# EAGLE design registers_half_block (EAGLE 9.5.2)
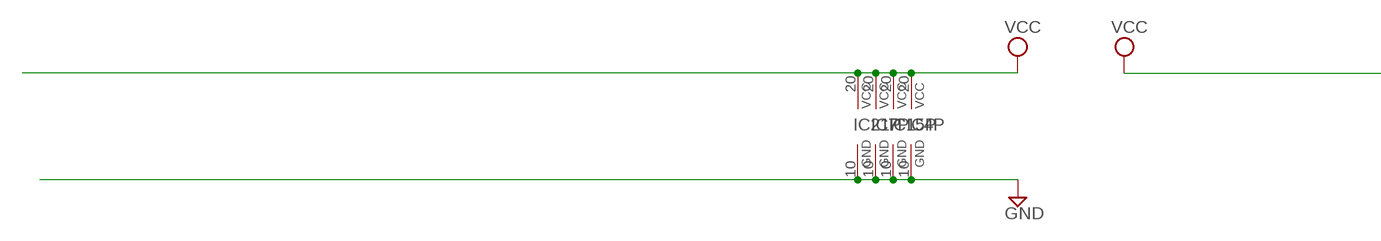
[diagram p0: schematic, sheet 1, part 1 of 3]
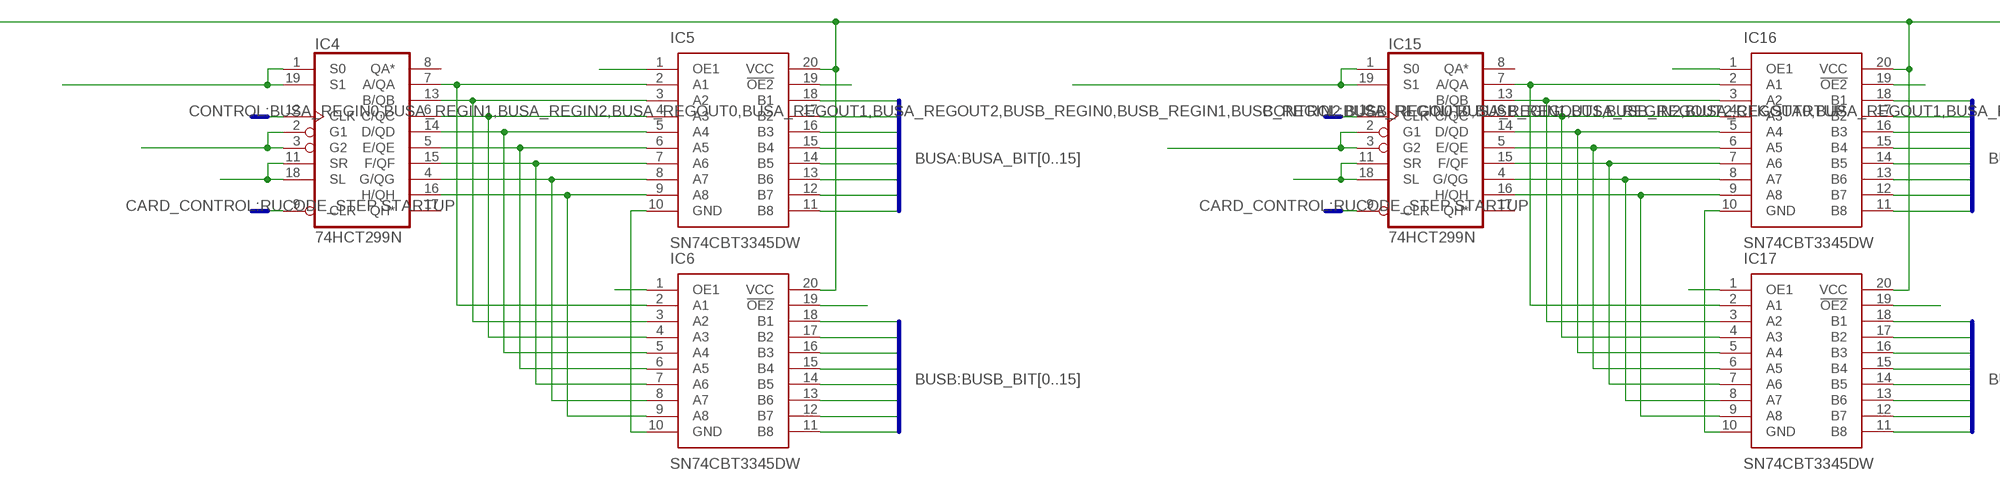
[diagram p1: schematic, sheet 1, part 2 of 3]
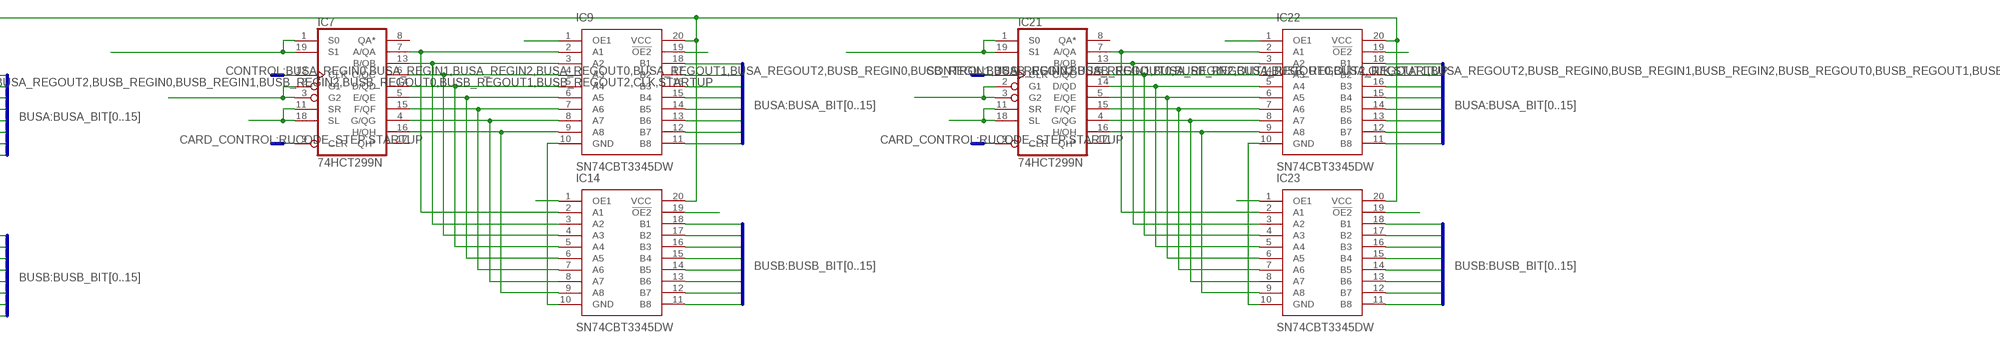
[diagram p2: schematic, sheet 1, part 3 of 3]

## Parts
IC4  74HCT299N  [DIL20]
IC5  SN74CBT3345DW  [SOIC127P1030X265-20N]
IC6  SN74CBT3345DW  [SOIC127P1030X265-20N]
IC7  74HCT299N  [DIL20]
IC9  SN74CBT3345DW  [SOIC127P1030X265-20N]
IC14  SN74CBT3345DW  [SOIC127P1030X265-20N]
IC15  74HCT299N  [DIL20]
IC16  SN74CBT3345DW  [SOIC127P1030X265-20N]
IC17  SN74CBT3345DW  [SOIC127P1030X265-20N]
IC21  74HCT299N  [DIL20]
IC22  SN74CBT3345DW  [SOIC127P1030X265-20N]
IC23  SN74CBT3345DW  [SOIC127P1030X265-20N]

## Nets
BUSA_BIT0: IC5.18(B1) IC9.18(B1) IC16.18(B1) IC22.18(B1)
BUSA_BIT1: IC5.17(B2) IC9.17(B2) IC16.17(B2) IC22.17(B2)
BUSA_BIT2: IC5.16(B3) IC9.16(B3) IC16.16(B3) IC22.16(B3)
BUSA_BIT3: IC5.15(B4) IC9.15(B4) IC16.15(B4) IC22.15(B4)
BUSA_BIT4: IC5.14(B5) IC9.14(B5) IC16.14(B5) IC22.14(B5)
BUSA_BIT5: IC5.13(B6) IC9.13(B6) IC16.13(B6) IC22.13(B6)
BUSA_BIT6: IC5.12(B7) IC9.12(B7) IC16.12(B7) IC22.12(B7)
BUSA_BIT7: IC5.11(B8) IC9.11(B8) IC16.11(B8) IC22.11(B8)
BUSB_BIT0: IC6.18(B1) IC14.18(B1) IC17.18(B1) IC23.18(B1)
BUSB_BIT1: IC6.17(B2) IC14.17(B2) IC17.17(B2) IC23.17(B2)
BUSB_BIT2: IC6.16(B3) IC14.16(B3) IC17.16(B3) IC23.16(B3)
BUSB_BIT3: IC6.15(B4) IC14.15(B4) IC17.15(B4) IC23.15(B4)
BUSB_BIT4: IC6.14(B5) IC14.14(B5) IC17.14(B5) IC23.14(B5)
BUSB_BIT5: IC6.13(B6) IC14.13(B6) IC17.13(B6) IC23.13(B6)
BUSB_BIT6: IC6.12(B7) IC14.12(B7) IC17.12(B7) IC23.12(B7)
BUSB_BIT7: IC6.11(B8) IC14.11(B8) IC17.11(B8) IC23.11(B8)
CLK: IC4.12(CLK) IC7.12(CLK) IC15.12(CLK) IC21.12(CLK)
GND: IC4.10(GND) IC7.10(GND) IC15.10(GND) IC21.10(GND)
N$1: IC5.19(!OE2)
N$2: IC21.11(SR) IC21.18(SL)
N$4: IC16.19(!OE2)
N$5: IC4.7(A/QA) IC5.2(A1) IC6.2(A1)
N$6: IC4.13(B/QB) IC5.3(A2) IC6.3(A2)
N$7: IC4.6(C/QC) IC5.4(A3) IC6.4(A3)
N$8: IC4.14(D/QD) IC5.5(A4) IC6.5(A4)
N$9: IC4.5(E/QE) IC5.6(A5) IC6.6(A5)
N$10: IC4.15(F/QF) IC5.7(A6) IC6.7(A6)
N$11: IC4.4(G/QG) IC5.8(A7) IC6.8(A7)
N$12: IC17.19(!OE2)
N$13: IC14.1(OE1)
N$14: IC9.19(!OE2)
N$15: IC4.16(H/QH) IC5.9(A8) IC6.9(A8)
N$17: IC14.19(!OE2)
N$18: IC22.19(!OE2)
N$19: IC23.19(!OE2)
N$20: IC23.1(OE1)
N$22: IC7.7(A/QA) IC9.2(A1) IC14.2(A1)
N$23: IC7.13(B/QB) IC9.3(A2) IC14.3(A2)
N$24: IC7.6(C/QC) IC9.4(A3) IC14.4(A3)
N$25: IC7.14(D/QD) IC9.5(A4) IC14.5(A4)
N$28: IC7.5(E/QE) IC9.6(A5) IC14.6(A5)
N$30: IC4.11(SR) IC4.18(SL)
N$31: IC5.10(GND) IC6.10(GND)
N$32: IC15.11(SR) IC15.18(SL)
N$33: IC16.10(GND) IC17.10(GND)
N$34: IC5.1(OE1)
N$35: IC7.15(F/QF) IC9.7(A6) IC14.7(A6)
N$36: IC7.4(G/QG) IC9.8(A7) IC14.8(A7)
N$37: IC7.16(H/QH) IC9.9(A8) IC14.9(A8)
N$39: IC7.11(SR) IC7.18(SL)
N$40: IC9.10(GND) IC14.10(GND)
N$41: IC15.7(A/QA) IC16.2(A1) IC17.2(A1)
N$42: IC15.13(B/QB) IC16.3(A2) IC17.3(A2)
N$43: IC15.6(C/QC) IC16.4(A3) IC17.4(A3)
N$44: IC15.14(D/QD) IC16.5(A4) IC17.5(A4)
N$45: IC15.5(E/QE) IC16.6(A5) IC17.6(A5)
N$46: IC15.15(F/QF) IC16.7(A6) IC17.7(A6)
N$47: IC15.4(G/QG) IC16.8(A7) IC17.8(A7)
N$48: IC15.16(H/QH) IC16.9(A8) IC17.9(A8)
N$50: IC22.10(GND) IC23.10(GND)
N$63: IC21.7(A/QA) IC22.2(A1) IC23.2(A1)
N$64: IC21.13(B/QB) IC22.3(A2) IC23.3(A2)
N$65: IC21.6(C/QC) IC22.4(A3) IC23.4(A3)
N$66: IC21.14(D/QD) IC22.5(A4) IC23.5(A4)
N$67: IC21.5(E/QE) IC22.6(A5) IC23.6(A5)
N$68: IC21.15(F/QF) IC22.7(A6) IC23.7(A6)
N$69: IC21.4(G/QG) IC22.8(A7) IC23.8(A7)
N$70: IC21.16(H/QH) IC22.9(A8) IC23.9(A8)
N$123: IC6.1(OE1)
N$124: IC6.19(!OE2)
N$127: IC4.2(G1) IC4.3(G2)
N$128: IC4.1(S0) IC4.19(S1)
N$137: IC15.2(G1) IC15.3(G2)
N$138: IC15.1(S0) IC15.19(S1)
N$147: IC7.2(G1) IC7.3(G2)
N$148: IC7.1(S0) IC7.19(S1)
N$157: IC21.2(G1) IC21.3(G2)
N$158: IC21.1(S0) IC21.19(S1)
N$169: IC16.1(OE1)
N$170: IC17.1(OE1)
N$171: IC9.1(OE1)
N$175: IC22.1(OE1)
STARTUP: IC4.9(CLR) IC7.9(CLR) IC15.9(CLR) IC21.9(CLR)
VCC: IC4.20(VCC) IC5.20(VCC) IC6.20(VCC) IC7.20(VCC) IC9.20(VCC) IC14.20(VCC) IC15.20(VCC) IC16.20(VCC) IC17.20(VCC) IC21.20(VCC) IC22.20(VCC) IC23.20(VCC)
Unconnected: IC4.8(QA*) IC4.17(QH*) IC7.8(QA*) IC7.17(QH*) IC15.8(QA*) IC15.17(QH*) IC21.8(QA*) IC21.17(QH*)

## Buses
CONTROL:BUSA_REGIN0,BUSA_REGIN1,BUSA_REGIN2,BUSA_REGOUT0,BUSA_REGOUT1,BUSA_REGOUT2,BUSB_REGIN0,BUSB_REGIN1,BUSB_REGIN2,BUSB_REGOUT0,BUSB_REGOUT1,BUSB_REGOUT2,CLK,STARTUP
CARD_CONTROL:RUCODE_STEP,STARTUP
BUSA:BUSA_BIT[0..15]
BUSB:BUSB_BIT[0..15]

## Library data of the parts
IC4 IC7 IC15 IC21 = 74xx-eu:74*299: 8-bit universal SHIFT/STORAGE REGISTER
IC5 IC6 IC9 IC14 IC16 IC17 IC22 IC23 = SamacSys_Parts:SN74CBT3345DW: Texas Instruments SN74CBT3345DW, Bus Switch, 8 x 1:1, 4.5 5.5 V, 20-Pin SOIC Source: Datasheet <https://www.ti.com/lit/ds/symlink/sn74cbt3345.pdf>; DESCRIPTION: Texas Instruments SN74CBT3345DW, Bus Switch, 8 x 1:1, 4.5 5.5 V, 20-Pin SOIC; HEIGHT: 2.65mm; MANUFACTURER_NAME: Texas Instruments; MANUFACTURER_PART_NUMBER: SN74CBT3345DW

## Board
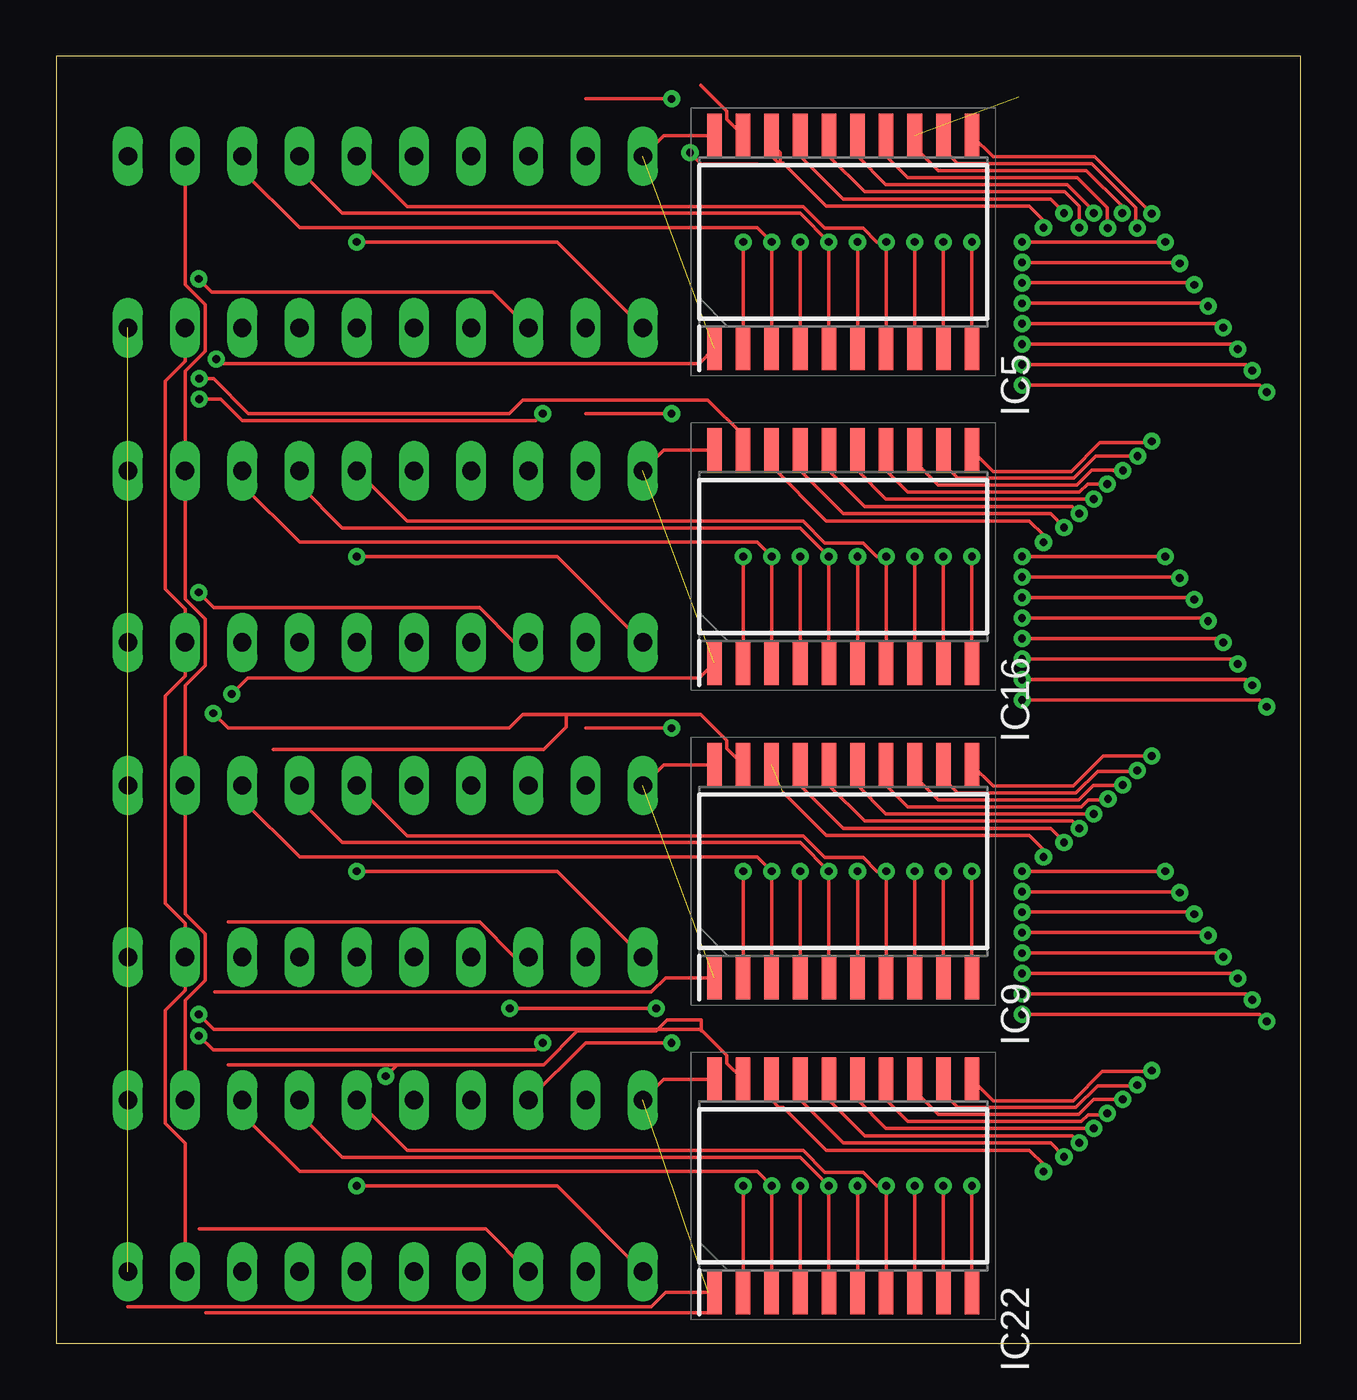
[diagram p3: board, top side]
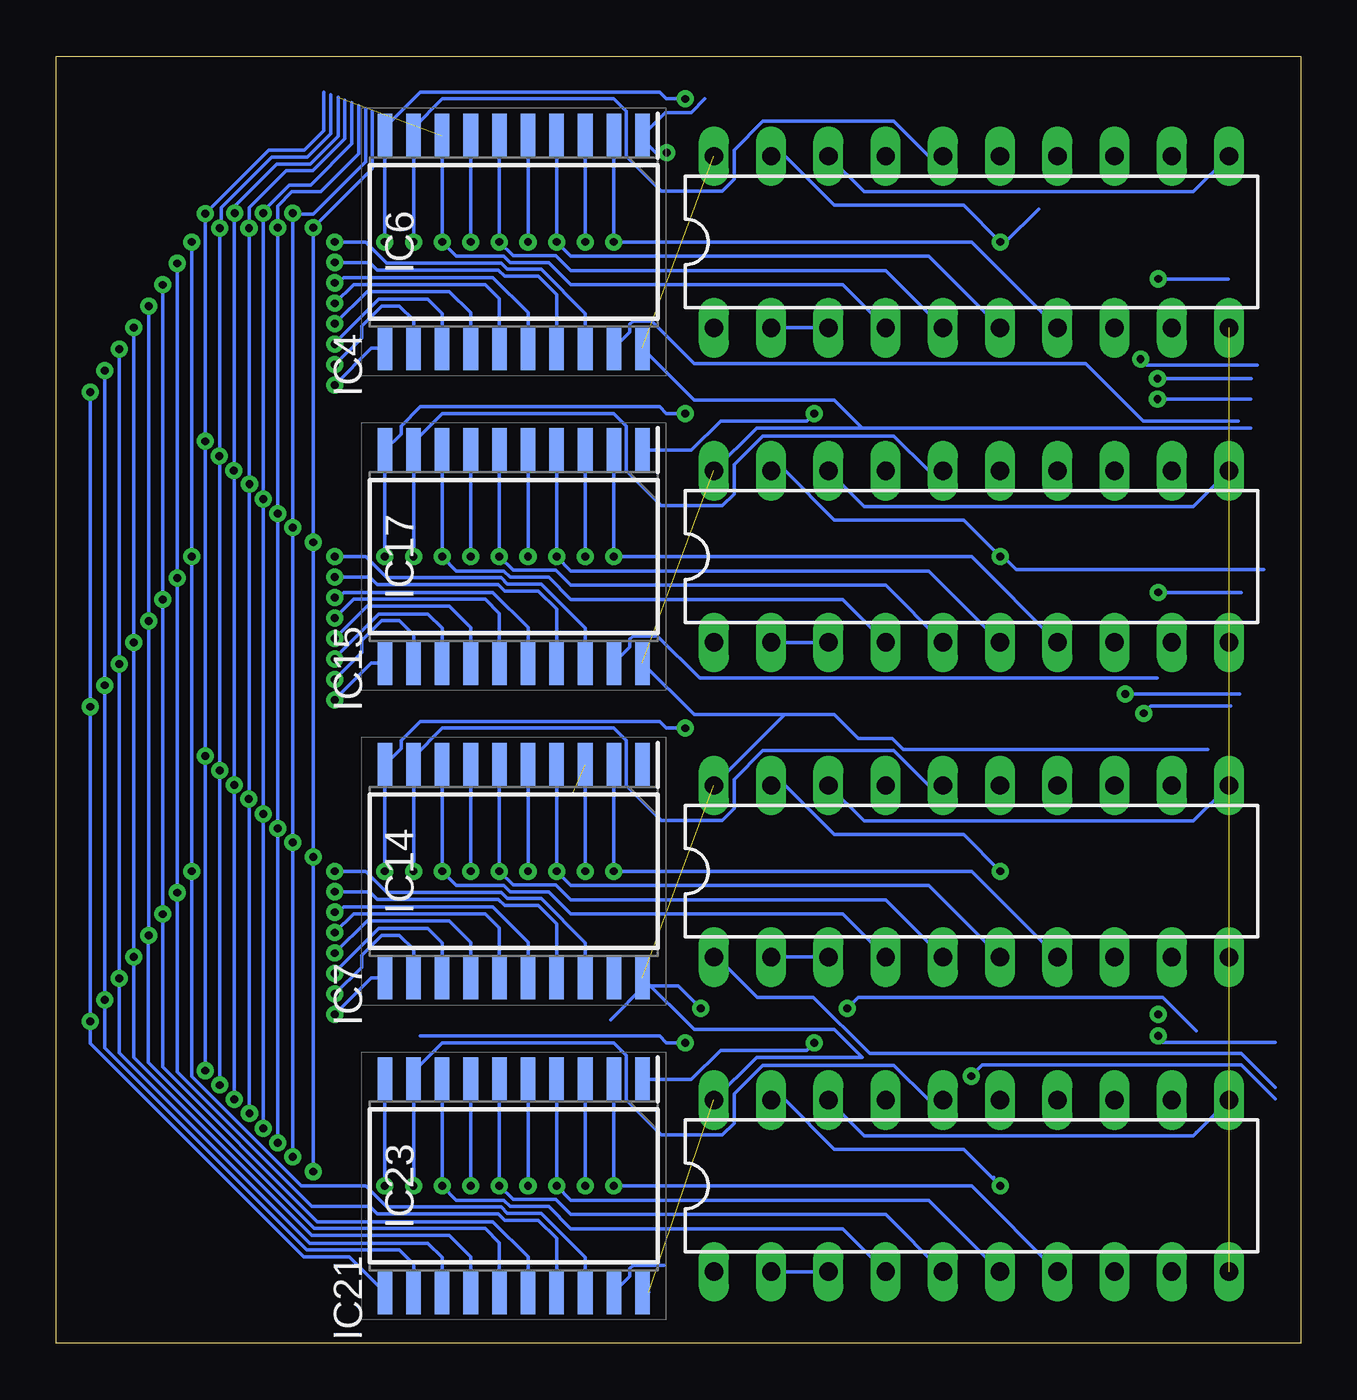
[diagram p4: board, bottom side, seen from below]

Size 55.23 x 57.14 mm. Coordinates in mm from the lower left corner, seen from the top.
Outline: 0,0 55.23,0 55.23,57.14 0,57.14 0,0
Copper layers (1*16): Top 0.035mm / dielectric 1.5mm / Bottom 0.035mm
Design rules "default *": minimum track width 6mil, minimum drill 0.35mm, track to track 6mil, track to pad 6mil, pad to pad 6mil, via to via 6mil, smd to smd 6mil, copper to edge 40mil, drill to drill 6mil, minimum pad ring 10mil, minimum via ring 8mil, stop-mask expansion 4mil, vias tented up to drill 0mil, thermal gap 10mil

### Footprints (pad centres in the part's own frame; a part is rotated, then mirrored left to right if it is on the bottom)
DIL20 = drill 0.813 long: 1 -11.43,-3.81; 2 -8.89,-3.81; 3 -6.35,-3.81; 4 -3.81,-3.81; 5 -1.27,-3.81; 6 1.27,-3.81; 7 3.81,-3.81; 8 6.35,-3.81; 9 8.89,-3.81; 10 11.43,-3.81; 11 11.43,3.81; 12 8.89,3.81; 13 6.35,3.81; 14 3.81,3.81; 15 1.27,3.81; 16 -1.27,3.81; 17 -3.81,3.81; 18 -6.35,3.81; 19 -8.89,3.81; 20 -11.43,3.81
SOIC127P1030X265-20N = smd 1.95 x 0.65: 1 -4.725,5.715; 2 -4.725,4.445; 3 -4.725,3.175; 4 -4.725,1.905; 5 -4.725,0.635; 6 -4.725,-0.635; 7 -4.725,-1.905; 8 -4.725,-3.175; 9 -4.725,-4.445; 10 -4.725,-5.715; 11 4.725,-5.715; 12 4.725,-4.445; 13 4.725,-3.175; 14 4.725,-1.905; 15 4.725,-0.635; 16 4.725,0.635; 17 4.725,1.905; 18 4.725,3.175; 19 4.725,4.445; 20 4.725,5.715

### Placement (x,y rotation side)
IC4  14.61,48.9 0 bottom
IC5  34.92,48.9 90 top
IC6  34.92,48.9 270 bottom
IC7  14.61,20.95 0 bottom
IC9  34.92,20.95 90 top
IC14  34.92,20.95 270 bottom
IC15  14.61,34.92 0 bottom
IC16  34.92,34.92 90 top
IC17  34.92,34.92 270 bottom
IC21  14.61,6.99 0 bottom
IC22  34.92,6.99 90 top
IC23  34.92,6.99 270 bottom

### Tracks (layer width: path | path; a pad name or v marks a point on that pad's centre or on a via)
BUSA_BIT0  (via drill 0.35)  (1 unrouted)
  Top 0.152: v43.81,49.53 43.81,49.85 43.18,50.48 34.18,50.48 32.27,52.39 32.12,52.39 | 31.75,52.7 32.07,52.39 32.12,52.39 | v43.81,35.56 43.81,35.88 43.18,36.51 34.18,36.51 31.75,38.94 IC16.18 31.62,39.36 | v43.81,21.59 43.81,21.91 43.18,22.54 34.18,22.54 32.27,24.45 | v43.81,7.62 43.81,7.94 43.18,8.57 34.18,8.57 32.27,10.48 32.07,10.48 31.75,10.79 IC22.18 | 31.62,25.86 IC9.18 | 32.12,52.39 32.12,52.86 31.62,53.36 IC5.18 | 32.12,52.36 32.12,52.39
  Bottom 0.152: v43.81,7.62 v43.81,21.59 v43.81,35.56 v43.81,49.53 41.19,52.15 41.19,54.69
BUSA_BIT1  (via drill 0.35)
  Top 0.152: v44.72,50.18 44.72,50.21 44.13,50.8 34.92,50.8 33.02,52.7 IC5.17 | v44.72,36.21 44.72,36.24 44.13,36.83 34.92,36.83 33.02,38.73 IC16.17 | v44.72,22.24 44.72,22.27 44.13,22.86 34.92,22.86 33.02,24.77 IC9.17 | v44.72,8.27 44.72,8.3 44.13,8.89 34.92,8.89 33.02,10.79 IC22.17
  Bottom 0.152: v44.72,8.27 v44.72,22.24 v44.72,36.21 v44.72,50.18 44.68,50.14 43.81,50.14 41.5,52.45 41.5,54.82
BUSA_BIT2  (via drill 0.35)
  Top 0.152: v45.4,49.53 45.4,50.48 44.77,51.12 35.88,51.12 34.29,52.7 IC5.16 | v45.4,36.83 45.09,37.15 35.88,37.15 34.29,38.73 IC16.16 | v45.4,22.86 45.09,23.18 35.88,23.18 34.29,24.77 IC9.16 | v45.4,8.89 45.09,9.21 35.88,9.21 34.29,10.79 IC22.16
  Bottom 0.152: v45.4,8.89 v45.4,22.86 v45.4,36.83 v45.4,49.53 45.4,50.48 44.77,51.12 43.5,51.12 41.8,52.81 41.8,54.94
BUSA_BIT3  (via drill 0.35)
  Top 0.152: IC5.15 35.56,52.7 36.82,51.45 44.87,51.45 46.05,50.27 v46.05,50.17 | IC16.15 35.56,38.73 36.82,37.48 v46.04,37.48 v46.05,37.47 | IC9.15 35.56,24.77 36.82,23.51 v46.04,23.51 v46.05,23.5 | IC22.15 35.56,10.79 36.82,9.53 v46.05,9.53
  Bottom 0.152: 42.11,55.07 42.11,53.26 43.94,51.42 44.89,51.42 46.05,50.27 v46.05,50.17 v46.05,37.47 v46.05,23.5 v46.05,9.53
BUSA_BIT4  (via drill 0.35, 0.35 pad 0.55)
  Top 0.152: IC5.14 36.83,52.7 37.78,51.75 45.32,51.75 46.65,50.42 46.65,49.52 v46.67,49.5 | IC16.14 36.83,38.73 37.78,37.78 45.4,37.78 45.77,38.15 v46.65,38.15 | IC9.14 36.83,24.77 37.78,23.81 45.5,23.81 45.79,24.11 46.63,24.11 v46.68,24.16 | IC22.14 36.83,10.79 37.78,9.84 45.5,9.84 45.79,10.14 46.58,10.14 v46.65,10.21
  Bottom 0.152: 42.41,55.2 42.41,53.47 43.84,52.05 45.03,52.05 46.65,50.42 46.65,49.52 v46.67,49.5 46.65,49.48 v46.65,38.15 46.65,24.18 | v46.65,10.21 46.65,24.18 | v46.68,24.16 46.65,24.18
BUSA_BIT5  (via drill 0.35, 0.35 pad 0.55)  (1 unrouted)
  Top 0.152: IC5.13 38.1,53.1 39.13,52.07 45.72,52.07 47.31,50.48 v47.31,50.16 | IC16.13 38.1,39.13 39.13,38.1 45.29,38.1 45.95,38.76 46.9,38.76 46.91,38.75 v47.34,38.75 | IC9.13 38.1,25.16 39.13,24.13 45.38,24.13 46.02,24.76 47.3,24.76 v47.33,24.79 | IC22.13 38.1,11.19 39.13,10.16 45.38,10.16 46.04,10.82 v47.33,10.82
  Bottom 0.152: v47.33,10.82 v47.33,24.79 47.33,38.42 | 42.72,55.32 42.72,53.6 43.96,52.35 45.44,52.35 47.33,50.46 47.33,38.42 | 47.33,38.42 47.34,38.43 v47.34,38.75
BUSA_BIT6  (via drill 0.35, 0.35 pad 0.55)
  Top 0.152: IC5.12 39.37,53.01 40.01,52.38 45.96,52.38 47.91,50.42 47.91,49.56 v47.97,49.5 | IC16.12 39.37,39.04 40.01,38.41 45.16,38.41 46.14,39.38 v47.99,39.38 | IC9.12 39.37,25.07 40.01,24.43 45.26,24.43 46.22,25.39 47.94,25.39 v47.97,25.43 | IC22.12 39.37,11.1 40.01,10.46 45.26,10.46 46.22,11.43 47.94,11.43 v47.97,11.46
  Bottom 0.152: 45.4,52.66 44.09,52.66 43.04,53.7 43.04,55.43 | v47.97,11.46 v47.97,25.43 47.97,39.69 | v47.97,11.46 | 47.97,48.29 | 47.97,39.69 47.97,48.29 | 47.97,39.69 47.99,39.67 v47.99,39.38 | 47.97,48.29 v47.97,49.5 | v47.97,49.5 | 45.4,52.66 | v47.97,49.5 47.91,49.56 47.91,50.42 45.67,52.66 45.4,52.66
BUSA_BIT7  (via drill 0.35, 0.35 pad 0.55)
  Top 0.152: IC5.11 41.58,52.68 46.08,52.68 48.22,50.54 v48.62,50.14 | IC9.11 41.58,24.74 45.13,24.74 46.46,26.07 v48.62,26.07 | IC22.11 41.58,10.77 45.13,10.77 46.43,12.07 48.58,12.07 v48.62,12.1 | IC16.11 41.58,38.71 45.04,38.71 46.32,39.99 48.56,39.99 v48.62,40.04 | v48.62,26.07
  Bottom 0.152: 43.35,55.55 43.35,53.83 44.21,52.97 45.8,52.97 48.22,50.54 v48.62,50.14 | v48.62,12.1 v48.62,26.07 | v48.62,26.07 | v48.62,26.07 v48.62,40.04 | v48.62,40.04 | v48.62,50.14 | v48.62,40.04 v48.62,50.14
BUSB_BIT0  (via drill 0.35)
  Top 0.152: v42.86,48.9 v49.22,48.9 | v42.86,20.95 v49.22,20.95 | v49.22,34.92 v42.86,34.92
  Bottom 0.152: IC6.18 31.75,45.72 33.71,47.68 35.21,47.68 35.48,47.95 40.56,47.95 41.5,48.9 v42.86,48.9 | IC17.18 31.75,31.75 33.71,33.71 35.21,33.71 35.48,33.98 40.56,33.98 41.5,34.92 v42.86,34.92 | IC14.18 31.75,17.78 33.71,19.74 35.21,19.74 35.48,20.02 40.56,20.02 41.5,20.95 v42.86,20.95 | IC23.18 31.75,3.81 33.71,5.77 35.21,5.77 35.48,6.04 40.56,6.04 41.5,6.99 44.36,6.99 49.22,11.85 v49.22,20.95 49.22,34.61 | 49.22,34.61 v49.22,48.9 | v49.22,48.9 | 49.22,34.61 | 49.22,34.61 v49.22,34.92
BUSB_BIT1  (via drill 0.35, 0.35 pad 0.55)
  Top 0.152: v42.86,34.02 49.82,34.02 v49.86,33.97 | v42.86,20.05 49.82,20.05 v49.86,20 | v42.86,47.99 49.82,47.99 v49.86,47.94
  Bottom 0.152: v42.86,47.99 41.32,47.99 40.98,47.65 35.61,47.65 35.33,47.37 33.84,47.37 33.02,46.56 IC6.17 | v42.86,34.02 41.32,34.02 40.98,33.68 35.61,33.68 35.33,33.4 33.84,33.4 33.02,32.59 IC17.17 | v42.86,20.05 41.32,20.05 40.98,19.71 35.61,19.71 35.33,19.43 33.84,19.43 33.02,18.62 IC14.17 | IC23.17 33.02,4.65 33.84,5.46 35.33,5.46 35.61,5.74 40.98,5.74 41.32,6.08 43.89,6.08 49.86,12.05 v49.86,20 49.86,20.3 49.86,20.31 v49.86,33.97 v49.86,47.94
BUSB_BIT2  (via drill 0.35, 0.35 pad 0.55)
  Top 0.152: v42.86,19.14 50.42,19.14 v50.51,19.05 | v42.86,33.11 50.42,33.11 v50.51,33.02 | v42.86,47.08 50.42,47.08 v50.51,46.99
  Bottom 0.152: IC6.16 34.29,45.74 35.85,47.31 42.46,47.31 42.69,47.08 v42.86,47.08 | IC17.16 34.29,31.77 35.85,33.34 42.46,33.34 42.69,33.11 v42.86,33.11 | IC14.16 34.29,17.8 35.85,19.37 42.46,19.37 42.69,19.14 v42.86,19.14 | IC23.16 34.29,3.83 35.85,5.4 43.64,5.4 50.51,12.26 v50.51,19.05 v50.51,33.02 v50.51,46.99
BUSB_BIT3  (via drill 0.35, 0.35 pad 0.55)
  Top 0.152: v42.86,18.23 50.99,18.23 v51.12,18.1 | v42.86,32.2 50.99,32.2 v51.12,32.07 | v42.86,46.17 50.99,46.17 v51.12,46.04
  Bottom 0.152: v42.86,46.17 42.03,47 36.2,47 35.56,46.37 IC6.15 | v42.86,32.2 42.03,33.03 36.2,33.03 35.56,32.4 IC17.15 | v42.86,18.23 42.03,19.06 36.2,19.06 35.56,18.43 IC14.15 | IC23.15 35.56,4.46 36.2,5.09 43.77,5.09 51.15,12.47 51.15,18.07 v51.12,18.1 v51.12,32.07 v51.12,46.04
BUSB_BIT4  (via drill 0.35, 0.35 pad 0.55)
  Top 0.152: v42.86,31.29 51.62,31.29 v51.79,31.11 | v42.86,17.32 51.62,17.32 v51.79,17.14 | v42.86,45.26 51.62,45.26 v51.79,45.09
  Bottom 0.152: IC6.14 36.83,45.74 37.78,46.7 41.42,46.7 v42.86,45.26 | IC17.14 36.83,31.77 37.78,32.73 41.42,32.73 v42.86,31.29 | IC14.14 36.83,17.8 37.78,18.76 41.42,18.76 v42.86,17.32 | IC23.14 36.83,3.83 37.78,4.79 43.89,4.79 51.79,12.68 v51.79,17.14 v51.79,31.11 v51.79,45.09
BUSB_BIT5  (via drill 0.35, 0.35 pad 0.55)
  Top 0.152: v42.86,30.38 52.22,30.38 v52.43,30.16 | v42.86,16.41 52.22,16.41 v52.43,16.19 | v42.86,44.35 52.22,44.35 v52.43,44.13
  Bottom 0.152: IC6.13 38.1,45.72 38.73,46.35 40.91,46.35 42.86,44.4 v42.86,44.35 | IC17.13 38.1,31.75 38.73,32.38 40.91,32.38 42.86,30.43 v42.86,30.38 | IC14.13 38.1,17.78 38.73,18.41 40.91,18.41 42.86,16.46 v42.86,16.41 | IC23.13 38.1,3.81 38.73,4.45 43.98,4.45 52.43,12.9 v52.43,16.19 v52.43,30.16 v52.43,44.13
BUSB_BIT6  (via drill 0.35, 0.35 pad 0.55)
  Top 0.152: v42.86,15.5 52.81,15.5 v53.08,15.24 | v42.86,29.47 52.81,29.47 v53.08,29.21 | v42.86,43.44 52.81,43.44 v53.08,43.18
  Bottom 0.152: v42.86,43.44 41.67,44.63 41.67,45.16 40.78,46.05 40.01,46.05 39.37,45.41 IC6.12 | v42.86,29.47 41.67,30.66 41.67,31.19 40.78,32.08 40.01,32.08 39.37,31.45 IC17.12 | IC14.12 39.37,17.48 40.01,18.11 40.78,18.11 41.67,17.22 41.67,16.69 v42.86,15.5 | IC23.12 39.37,3.5 40.01,4.14 44.11,4.14 53.08,13.11 v53.08,15.24 v53.08,29.21 v53.08,43.18
BUSB_BIT7  (via drill 0.35, 0.35 pad 0.55)
  Top 0.152: v42.86,14.59 53.41,14.59 v53.72,14.29 | v42.86,28.56 53.41,28.56 v53.72,28.26 | v42.86,42.53 53.41,42.53 v53.72,42.23
  Bottom 0.152: IC6.11 41.24,44.17 42.86,42.55 v42.86,42.53 | IC17.11 41.24,30.2 42.86,28.57 v42.86,28.56 | IC14.11 41.24,16.23 42.86,14.61 v42.86,14.59 | v53.72,42.23 v53.72,28.26 v53.72,14.29 53.72,13.32 44.23,3.83 42.22,3.83 IC23.11
CLK
  Top 0.152: IC4.12 5.71,47 6.6,46.11 6.6,44.06 5.71,43.17 IC15.12 5.71,33.03 6.6,32.14 6.6,30.09 5.71,29.2 IC7.12 5.71,19.06 6.6,18.17 6.6,16.12 5.71,15.23 IC21.12
GND  (3 unrouted)
  Bottom 0.152: 3.12,45.36 IC4.10
N$1
  Top 0.152: IC5.19 29.76,54.34 29.76,54.69 28.6,55.85
N$2  (via drill 0.35)
  Top 0.152: v27.3,13.34 23.5,13.34 IC21.18
  Bottom 0.152: IC21.18 19.37,9.21 4.76,9.21 4.62,9.35 | 4.62,9.35 IC21.11 | v27.3,13.34 28.14,13.34 28.45,13.64 39.06,13.64 | 4.62,9.36 4.62,9.35
N$4  (via drill 0.35)
  Top 0.152: v6.35,42.82 6.99,42.82 8.53,41.27 20.1,41.27 20.7,41.88 28.92,41.88 30.48,40.32 IC16.19
  Bottom 0.152: v6.35,42.82 2.18,42.82
N$5  (via drill 0.35)
  Top 0.152: v30.48,48.9 IC5.2
  Bottom 0.152: IC6.2 v30.48,48.9 14.61,48.9 IC4.7
N$6  (via drill 0.35)
  Top 0.152: IC5.3 v31.75,48.9 31.11,49.53 10.79,49.53 8.26,52.07 IC4.13
  Bottom 0.152: v31.75,48.9 IC6.3
N$7  (via drill 0.35)
  Top 0.152: v33.02,48.9 IC5.4
  Bottom 0.152: IC6.4 v33.02,48.9 32.38,48.26 16.51,48.26 IC4.6
N$8  (via drill 0.35)
  Top 0.152: IC5.5 v34.29,48.9 33.02,50.16 12.7,50.16 10.79,52.07 IC4.14
  Bottom 0.152: IC6.5 v34.29,48.9
N$9  (via drill 0.35)
  Top 0.152: v35.56,48.9 IC5.6
  Bottom 0.152: IC6.6 v35.56,48.9 34.95,48.29 33.05,48.29 32.38,47.62 18.41,47.62 IC4.5
N$10  (via drill 0.35)
  Top 0.152: IC5.7 v36.83,48.9 36.42,48.9 35.81,49.5 34.11,49.5 33.15,50.47 15.57,50.47 IC4.15
  Bottom 0.152: IC6.7 v36.83,48.9
N$11  (via drill 0.35)
  Top 0.152: v38.1,48.9 IC5.8
  Bottom 0.152: IC6.8 v38.1,48.9 37.47,48.26 35.36,48.26 35.08,47.98 33.38,47.98 32.38,46.99 20.32,46.99 IC4.4
N$12
  Bottom 0.152: IC17.19 29.76,30.92 29.76,31.27 29.63,31.4 28.55,31.4 26.67,29.53 6.36,29.53
N$14  (via drill 0.35)
  Top 0.152: IC9.19 29.76,26.4 29.76,26.75 28.6,27.91 22.62,27.91 | 22.62,27.91 20.7,27.91 20.1,27.3 7.62,27.3 v6.96,27.97 | 22.62,27.91 22.62,27.36 21.62,26.36 9.62,26.36
  Bottom 0.152: v6.96,27.97 6.64,28.29 3.11,28.29
N$15  (via drill 0.35)
  Top 0.152: IC5.9 v39.37,48.9
  Bottom 0.152: v39.37,48.9 IC6.9 39.37,53.97 38.1,55.24 30.48,55.24 29.93,54.69 29.93,52.71 28.37,51.16 25.67,51.16 25.15,51.68 25.15,52.97 23.86,54.25 18.05,54.25 16.5,52.7 IC4.16
N$18  (via drill 0.35)
  Top 0.152: IC22.19 29.76,12.43 29.76,12.78 28.66,13.89 | 28.66,13.89 28.6,13.94 6.99,13.94 v6.32,14.61 | 15.12,12.36 v14.62,11.86 | 15.12,12.36 21.62,12.36 23.12,13.86 26.62,13.86 27.12,14.36 28.62,14.36 28.62,13.86 28.66,13.89 | 15.12,12.36 7.62,12.36
  Bottom 0.152: 1.12,10.86 2.62,12.36 14.12,12.36 v14.62,11.86
N$19
  Bottom 0.152: IC23.19 29.76,2.98 29.76,3.33 29.63,3.46 28.24,3.46
N$20  (via drill 0.35)
  Top 0.152: v21.59,13.34 21.27,13.02 6.96,13.02 v6.32,13.65
  Bottom 0.152: v21.59,13.34 21.92,13.01 25.74,13.01 27.04,11.71 IC23.1 | 6.32,13.62 v6.32,13.65 6.12,13.36 1.12,13.36
N$22  (via drill 0.35)
  Top 0.152: v30.48,20.95 IC9.2
  Bottom 0.152: IC14.2 v30.48,20.95 14.61,20.95 IC7.7
N$23  (via drill 0.35)
  Top 0.152: IC9.3 v31.75,20.95 31.11,21.59 10.79,21.59 8.26,24.13 IC7.13
  Bottom 0.152: v31.75,20.95 IC14.3
N$24  (via drill 0.35)
  Top 0.152: v33.02,20.95 IC9.4
  Bottom 0.152: IC14.4 v33.02,20.95 32.38,20.32 16.51,20.32 IC7.6
N$25  (via drill 0.35)
  Top 0.152: IC9.5 v34.29,20.95 33.02,22.23 12.7,22.23 10.79,24.13 IC7.14
  Bottom 0.152: IC14.5 v34.29,20.95
N$28  (via drill 0.35)
  Top 0.152: v35.56,20.95 IC9.6
  Bottom 0.152: IC14.6 v35.56,20.95 34.95,20.35 33.05,20.35 32.38,19.68 18.41,19.68 IC7.5
N$30
  Top 0.152: 3.12,52.86 IC4.11
  Bottom 0.152: IC4.18 19.37,51.12 4.76,51.12 IC4.11
N$31  (via drill 0.35)
  Top 0.152: v27.3,55.24 23.5,55.24 | v40.64,48.9 IC5.10
  Bottom 0.152: v27.3,55.24 28.14,55.24 28.45,55.55 39.06,55.55 39.84,54.77 | 39.92,54.69 39.84,54.77 | v40.64,48.9 IC6.10 40.64,53.98 39.85,54.77 39.84,54.77
N$32
  Bottom 0.152: IC15.18 19.37,37.15 4.76,37.15 IC15.11 3.12,38.86
N$33  (via drill 0.35)
  Top 0.152: v40.64,34.92 IC16.10 | v27.3,41.27 23.5,41.27
  Bottom 0.152: v40.64,34.92 IC17.10 39.92,40.37 39.92,40.72 39.06,41.58 28.45,41.58 28.14,41.27 v27.3,41.27
N$34  (via drill 0.35)
  Top 0.152: IC5.1 28.54,43.5 7.3,43.5 v7.1,43.7
  Bottom 0.152: v7.1,43.7 6.83,43.43 1.93,43.43
N$35  (via drill 0.35)
  Top 0.152: IC9.7 v36.83,20.95 36.42,20.95 35.81,21.56 34.11,21.56 33.15,22.53 15.57,22.53 IC7.15
  Bottom 0.152: IC14.7 v36.83,20.95
N$36  (via drill 0.35)
  Top 0.152: v38.1,20.95 IC9.8
  Bottom 0.152: IC14.8 v38.1,20.95 37.47,20.32 35.36,20.32 35.08,20.04 33.38,20.04 32.38,19.05 20.32,19.05 IC7.4
N$37  (via drill 0.35)
  Top 0.152: v39.37,20.95 IC9.9
  Bottom 0.152: v39.37,20.95 IC14.9 39.37,26.03 38.1,27.3 30.48,27.3 29.93,26.75 29.93,24.77 28.37,23.22 25.67,23.22 25.15,23.74 25.15,25.03 23.86,26.31 18.05,26.31 16.5,24.77 IC7.16
N$39
  Bottom 0.152: IC7.18 19.37,23.18 4.76,23.18 IC7.11
N$40  (via drill 0.35)
  Top 0.152: v40.64,20.95 IC9.10 | v27.3,27.3 23.5,27.3
  Bottom 0.152: v40.64,20.95 IC14.10 39.92,26.4 39.92,26.75 39.06,27.61 28.45,27.61 28.14,27.3 v27.3,27.3
N$41  (via drill 0.35)
  Top 0.152: v30.48,34.92 IC16.2
  Bottom 0.152: IC17.2 v30.48,34.92 14.61,34.92 IC15.7
N$42  (via drill 0.35)
  Top 0.152: IC16.3 v31.75,34.92 31.11,35.56 10.79,35.56 8.26,38.1 IC15.13
  Bottom 0.152: v31.75,34.92 IC17.3
N$43  (via drill 0.35)
  Top 0.152: v33.02,34.92 IC16.4
  Bottom 0.152: IC17.4 v33.02,34.92 32.38,34.29 16.51,34.29 IC15.6
N$44  (via drill 0.35)
  Top 0.152: IC16.5 v34.29,34.92 33.02,36.2 12.7,36.2 10.79,38.1 IC15.14
  Bottom 0.152: IC17.5 v34.29,34.92
N$45  (via drill 0.35)
  Top 0.152: v35.56,34.92 IC16.6
  Bottom 0.152: IC17.6 v35.56,34.92 34.95,34.32 33.05,34.32 32.38,33.66 18.41,33.66 IC15.5
N$46  (via drill 0.35)
  Top 0.152: IC16.7 v36.83,34.92 36.42,34.92 35.81,35.53 34.11,35.53 33.15,36.5 15.57,36.5 IC15.15
  Bottom 0.152: IC17.7 v36.83,34.92
N$47  (via drill 0.35)
  Top 0.152: v38.1,34.92 IC16.8
  Bottom 0.152: IC17.8 v38.1,34.92 37.47,34.29 35.36,34.29 35.08,34.01 33.38,34.01 32.38,33.02 20.32,33.02 IC15.4
N$48  (via drill 0.35)
  Top 0.152: v39.37,34.92 IC16.9
  Bottom 0.152: v39.37,34.92 IC17.9 39.37,40 38.1,41.27 30.48,41.27 29.93,40.72 29.93,38.74 28.37,37.19 25.67,37.19 25.15,37.71 25.15,39 23.86,40.28 18.05,40.28 16.5,38.73 IC15.16
N$50  (via drill 0.35)
  Top 0.152: v40.64,6.99 IC22.10
  Bottom 0.152: IC23.10 v40.64,6.99
N$63  (via drill 0.35)
  Top 0.152: v30.48,6.99 IC22.2
  Bottom 0.152: IC23.2 v30.48,6.99 14.61,6.99 IC21.7
N$64  (via drill 0.35)
  Top 0.152: IC22.3 v31.75,6.99 31.11,7.62 10.79,7.62 8.26,10.16 IC21.13
  Bottom 0.152: v31.75,6.99 IC23.3
N$65  (via drill 0.35)
  Top 0.152: v33.02,6.99 IC22.4
  Bottom 0.152: IC23.4 v33.02,6.99 32.38,6.35 16.51,6.35 IC21.6
N$66  (via drill 0.35)
  Top 0.152: IC22.5 v34.29,6.99 33.02,8.26 12.7,8.26 10.79,10.16 IC21.14
  Bottom 0.152: IC23.5 v34.29,6.99
N$67  (via drill 0.35)
  Top 0.152: v35.56,6.99 IC22.6
  Bottom 0.152: IC23.6 v35.56,6.99 34.95,6.38 33.05,6.38 32.38,5.71 18.41,5.71 IC21.5
N$68  (via drill 0.35)
  Top 0.152: IC22.7 v36.83,6.99 36.42,6.99 35.81,7.59 34.11,7.59 33.15,8.56 15.57,8.56 IC21.15
  Bottom 0.152: IC23.7 v36.83,6.99
N$69  (via drill 0.35)
  Top 0.152: v38.1,6.99 IC22.8
  Bottom 0.152: IC23.8 v38.1,6.99 37.47,6.35 35.36,6.35 35.08,6.07 33.38,6.07 32.38,5.08 20.32,5.08 IC21.4
N$70  (via drill 0.35)
  Top 0.152: v39.37,6.99 IC22.9
  Bottom 0.152: v39.37,6.99 IC23.9 39.37,12.06 38.1,13.34 30.48,13.34 29.93,12.78 29.93,10.8 28.37,9.25 25.67,9.25 25.15,9.77 25.15,11.06 23.86,12.34 18.05,12.34 16.5,10.79 IC21.16
N$123  (via drill 0.35)
  Top 0.152: v28.12,52.86 28.62,52.36 31.12,52.36
  Bottom 0.152: 26.45,55.24 27.05,54.64 28.19,54.64 IC6.1 29.12,53.36 28.62,52.86 v28.12,52.86
N$124
  Bottom 0.152: IC6.19 29.76,44.89 29.76,45.24 29.63,45.37 28.79,45.37 26.91,43.5 9.53,43.5 6.97,40.95 2.78,40.95
N$127  (via drill 0.35)
  Top 0.152: IC4.3 19.37,46.67 6.9,46.67 v6.32,47.25
  Bottom 0.152: IC4.2 IC4.3 | 3.22,47.25 v6.32,47.25 6.12,47.36
N$128  (via drill 0.35)
  Top 0.152: v13.34,48.9 22.23,48.9 IC4.1
  Bottom 0.152: IC4.19 22.87,52.7 20.69,50.52 14.96,50.52 v13.34,48.9 13.12,48.86 11.62,50.36
N$137  (via drill 0.35)
  Top 0.152: IC15.3 20.33,31.11 18.78,32.66 7,32.66 v6.32,33.34
  Bottom 0.152: IC15.2 IC15.3 | v6.32,33.34 2.62,33.34
N$138  (via drill 0.35)
  Top 0.152: v13.34,34.92 22.23,34.92 IC15.1
  Bottom 0.152: IC15.19 22.87,38.73 20.69,36.55 14.96,36.55 v13.34,34.92 13.12,34.86 12.62,34.36 1.62,34.36
N$147
  Top 0.152: IC7.3 20.33,17.14 18.78,18.69 7.62,18.69
  Bottom 0.152: IC7.2 IC7.3
N$148  (via drill 0.35)
  Top 0.152: v13.34,20.95 22.23,20.95 IC7.1
  Bottom 0.152: IC7.19 22.87,24.77 20.69,22.58 14.96,22.58 v13.34,20.95 | 1.12,11.36 2.62,12.86 19.12,12.86 21.62,15.36 24.12,15.36 25.62,16.86 IC7.1
N$157
  Top 0.152: IC21.3 19.05,5.08 6.35,5.08
  Bottom 0.152: IC21.2 IC21.3
N$158  (via drill 0.35)
  Top 0.152: v13.34,6.99 22.23,6.99 IC21.1
  Bottom 0.152: IC21.19 22.87,10.79 20.69,8.61 14.96,8.61 13.67,7.32 | 13.67,7.32 v13.34,6.99 | 13.62,7.36 13.67,7.32
N$169  (via drill 0.35)
  Top 0.152: IC16.1 28.54,29.53 8.49,29.53 v7.79,28.82
  Bottom 0.152: v7.79,28.82 2.71,28.82
N$170  (via drill 0.35)
  Top 0.152: v21.59,41.27 21.29,40.97 8.24,40.97 7.3,41.91 v6.35,41.91
  Bottom 0.152: v21.59,41.27 21.92,40.95 25.74,40.95 27.04,39.65 IC17.1 | v6.35,41.91 2.22,41.91
N$171
  Top 0.152: IC9.1 27.04,16.23 26.4,15.6 7.02,15.6
N$175
  Top 0.152: 3.17,1.63 26.4,1.63 27.04,2.26 IC22.1 29.12,1.86 29.12,1.36 6.62,1.36
STARTUP
  Top 0.152: IC21.9 5.71,8.88 4.83,9.77 4.83,14.77 5.71,15.66 IC7.9 5.71,18.63 4.83,19.52 4.83,28.74 5.71,29.63 IC15.9 5.71,32.6 4.83,33.49 4.83,42.71 5.71,43.6 IC4.9
  Bottom 0.152: 6.12,2.86 IC21.9
VCC  (via drill 0.35)  (4 unrouted)
  Top 0.152: IC15.20 26.95,39.65 IC16.20 29.21,39.37 | IC7.20 26.95,25.68 IC9.20 29.21,25.4 | IC21.20 26.95,11.71 IC22.20 29.21,11.43 | 29.21,53.34 IC5.20 26.95,53.62 IC4.20 | v26.62,14.86 v20.12,14.86
  Bottom 0.152: IC7.20 22.89,27.91 | 22.89,27.91 26.92,27.91 IC17.20 | IC21.20 24.13,12.7 19.46,12.7 20.7,13.94 26.92,13.94 IC14.20 29.12,15.86 | 19.46,40.64 20.7,41.88 26.92,41.88 IC6.20 | IC15.20 24.13,40.64 19.46,40.64 | 28.93,2.26 IC23.20 29.12,1.86 | 22.89,27.91 20.7,27.91 19.64,26.84 19.62,26.86 18.12,26.86 17.62,26.36 4.12,26.36 | 19.46,40.64 2.22,40.64 | 30.62,14.36 29.12,15.86 | 4.62,13.86 6.12,15.36 19.62,15.36 v20.12,14.86 | v26.62,14.86 27.62,15.86 29.12,15.86